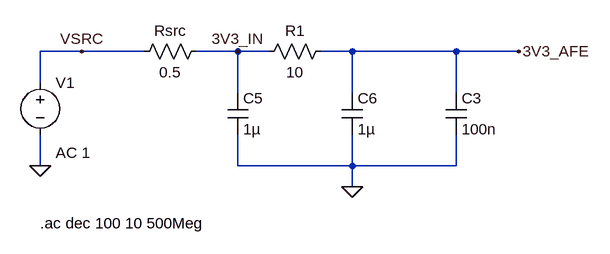
[diagram p0: schematic SomniMate_RIP_AFE_3V3_Pi_Filter.asc]
SomniMate_RIP_AFE_3V3_Pi_Filter.asc, the LTspice schematic file:
Version 4.1
SHEET 1 880 680
WIRE -352 80 -416 80
WIRE -256 80 -352 80
WIRE -112 80 -176 80
WIRE -64 80 -112 80
WIRE 64 80 16 80
WIRE 224 80 64 80
WIRE 320 80 224 80
WIRE -416 128 -416 80
WIRE -112 144 -112 80
WIRE 64 144 64 80
WIRE 224 144 224 80
WIRE -416 256 -416 208
WIRE -112 256 -112 208
WIRE 64 256 64 208
WIRE 64 256 -112 256
WIRE 224 256 224 208
WIRE 224 256 64 256
WIRE 64 288 64 256
FLAG 320 80 3V3_AFE
FLAG 64 288 0
FLAG -352 80 VSRC
FLAG -112 80 3V3_IN
FLAG -416 256 0
SYMBOL cap -128 144 R0
SYMATTR InstName C5
SYMATTR Value 1µ
SYMBOL cap 48 144 R0
SYMATTR InstName C6
SYMATTR Value 1µ
SYMBOL cap 208 144 R0
SYMATTR InstName C3
SYMATTR Value 100n
SYMBOL res 32 64 R90
WINDOW 0 0 56 VBottom 2
WINDOW 3 32 56 VTop 2
SYMATTR InstName R1
SYMATTR Value 10
SYMBOL res -160 64 R90
WINDOW 0 0 56 VBottom 2
WINDOW 3 32 56 VTop 2
SYMATTR InstName Rsrc
SYMATTR Value 0.5
SYMBOL voltage -416 112 R0
WINDOW 123 24 124 Left 2
WINDOW 39 0 0 Left 0
SYMATTR InstName V1
SYMATTR Value ""
SYMATTR Value2 AC 1
TEXT -416 344 Left 2 !.ac dec 100 10 500Meg

The netlist it stands for:
* SomniMate_RIP_AFE_3V3_Pi_Filter.asc
C5 3V3_IN 0 1µ
C6 3V3_AFE 0 1µ
C3 3V3_AFE 0 100n
R1 3V3_AFE 3V3_IN 10
Rsrc 3V3_IN VSRC 0.5
V1 VSRC 0 AC 1
.ac dec 100 10 500Meg
.backanno
.end